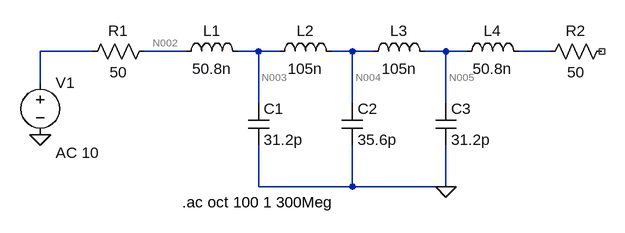
[diagram p0: schematic Vorbereitung1.asc]
Vorbereitung1.asc, the LTspice schematic file:
Version 4
SHEET 1 880 680
WIRE -64 112 -144 112
WIRE 80 112 16 112
WIRE 192 112 160 112
WIRE 224 112 192 112
WIRE 336 112 304 112
WIRE 368 112 336 112
WIRE 480 112 448 112
WIRE 512 112 480 112
WIRE 640 112 592 112
WIRE -144 160 -144 112
WIRE 192 192 192 112
WIRE 336 192 336 112
WIRE 480 192 480 112
WIRE 192 320 192 256
WIRE 336 320 336 256
WIRE 336 320 192 320
WIRE 480 320 480 256
WIRE 480 320 336 320
FLAG 480 320 0
FLAG -144 240 0
SYMBOL ind 64 128 R270
WINDOW 0 32 56 VTop 2
WINDOW 3 5 56 VBottom 2
SYMATTR InstName L1
SYMATTR Value 50.8n
SYMBOL ind 208 128 R270
WINDOW 0 32 56 VTop 2
WINDOW 3 5 56 VBottom 2
SYMATTR InstName L2
SYMATTR Value 105n
SYMBOL ind 352 128 R270
WINDOW 0 32 56 VTop 2
WINDOW 3 5 56 VBottom 2
SYMATTR InstName L3
SYMATTR Value 105n
SYMBOL ind 496 128 R270
WINDOW 0 32 56 VTop 2
WINDOW 3 5 56 VBottom 2
SYMATTR InstName L4
SYMATTR Value 50.8n
SYMBOL cap 176 192 R0
SYMATTR InstName C1
SYMATTR Value 31.2p
SYMBOL cap 320 192 R0
SYMATTR InstName C2
SYMATTR Value 35.6p
SYMBOL cap 464 192 R0
SYMATTR InstName C3
SYMATTR Value 31.2p
SYMBOL voltage -144 144 R0
WINDOW 123 24 124 Left 2
WINDOW 39 0 0 Left 2
SYMATTR InstName V1
SYMATTR Value ""
SYMATTR Value2 AC 10
SYMBOL res 32 96 R90
WINDOW 0 0 56 VBottom 2
WINDOW 3 32 56 VTop 2
SYMATTR InstName R1
SYMATTR Value 50
SYMBOL res 736 96 R90
WINDOW 0 0 56 VBottom 2
WINDOW 3 32 56 VTop 2
SYMATTR InstName R2
SYMATTR Value 50
TEXT 74 344 Left 2 !.ac oct 100 1 300Meg

The netlist it stands for:
* Vorbereitung1.asc
L1 N002 N003 50.8n
L2 N003 N004 105n
L3 N004 N005 105n
L4 N005 N006 50.8n
C1 N003 0 31.2p
C2 N004 0 35.6p
C3 N005 0 31.2p
V1 N001 0 AC 10
R1 N002 N001 50
R2 NC_01 N006 50
.ac oct 100 1 300Meg
.backanno
.end

* Results of the author's LTspice run, read from the files saved beside the schematic
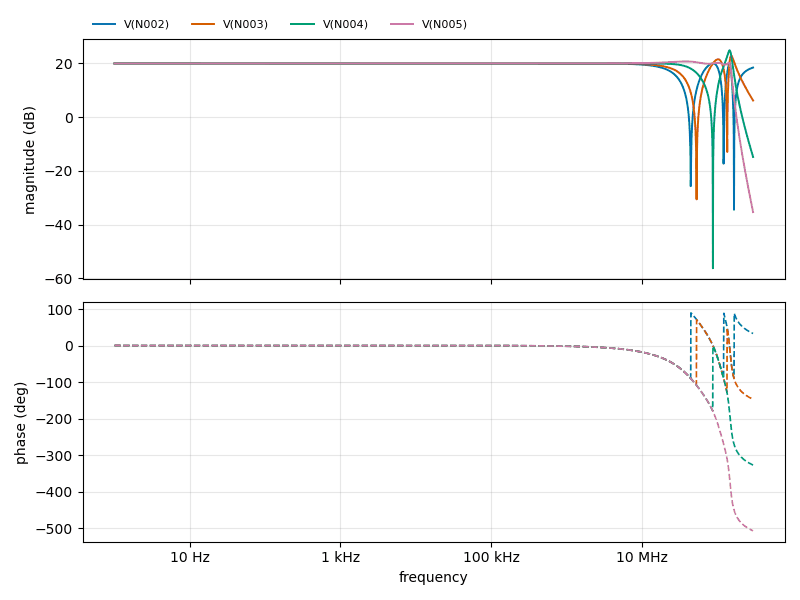
[diagram p1: AC Analysis of Vorbereitung1.asc, plotted from the saved traces]
* AC Analysis, 1 run:
*   V(N002): 20.00 dB at 1 Hz, 18.47 dB at 300 MHz, peak 20.00 dB at 7.21 Hz, 3 dB below the peak at 24.11 MHz
*   V(N003): 20.00 dB at 1 Hz, 6.21 dB at 300 MHz, peak 22.91 dB at 154.2 MHz, 3 dB below the peak at 145.8 MHz and 171 MHz
*   V(N004): 20.00 dB at 1 Hz, -14.77 dB at 300 MHz, peak 24.87 dB at 145.9 MHz, 3 dB below the peak at 133.1 MHz and 155.8 MHz
*   V(N005): 20.00 dB at 1 Hz, -35.31 dB at 300 MHz, peak 20.74 dB at 38.28 MHz, 3 dB below the peak at 152 MHz